# Altium schematic sheet BumpSensors.SchDoc
size A
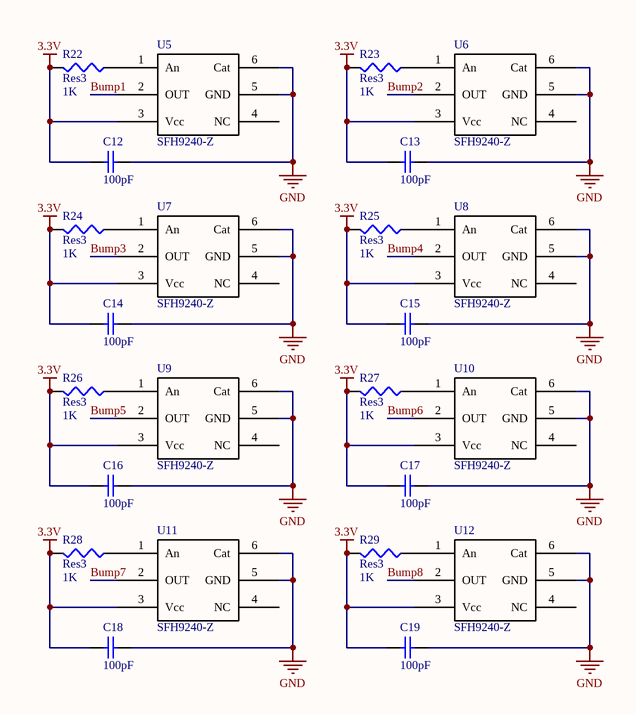
[diagram p0: BumpSensors.SchDoc]

## Parts
C12  value 100pF  [CAPC1005L]  (hidden comment: Cap Semi)
C13  value 100pF  [CAPC1005L]  (hidden comment: Cap Semi)
C14  value 100pF  [CAPC1005L]  (hidden comment: Cap Semi)
C15  value 100pF  [CAPC1005L]  (hidden comment: Cap Semi)
C16  value 100pF  [CAPC1005L]  (hidden comment: Cap Semi)
C17  value 100pF  [CAPC1005L]  (hidden comment: Cap Semi)
C18  value 100pF  [CAPC1005L]  (hidden comment: Cap Semi)
C19  value 100pF  [CAPC1005L]  (hidden comment: Cap Semi)
R22  Res3  value 1K  [RESC1608L]
R23  Res3  value 1K  [RESC1608L]
R24  Res3  value 1K  [RESC1608L]
R25  Res3  value 1K  [RESC1608L]
R26  Res3  value 1K  [RESC1608L]
R27  Res3  value 1K  [RESC1608L]
R28  Res3  value 1K  [RESC1608L]
R29  Res3  value 1K  [RESC1608L]
U5  SFH9240-Z  [SFH9240-Z]
U6  SFH9240-Z  [SFH9240-Z]
U7  SFH9240-Z  [SFH9240-Z]
U8  SFH9240-Z  [SFH9240-Z]
U9  SFH9240-Z  [SFH9240-Z]
U10  SFH9240-Z  [SFH9240-Z]
U11  SFH9240-Z  [SFH9240-Z]
U12  SFH9240-Z  [SFH9240-Z]

## Nets
3.3V: C12.2 C13.2 C14.2 C15.2 C16.2 C17.2 C18.2 C19.2 R22.2 R23.2 R24.2 R25.2 R26.2 R27.2 R28.2 R29.2 U5.3(Vcc) U6.3(Vcc) U7.3(Vcc) U8.3(Vcc) U9.3(Vcc) U10.3(Vcc) U11.3(Vcc) U12.3(Vcc)
GND: C12.1 C13.1 C14.1 C15.1 C16.1 C17.1 C18.1 C19.1 U5.5(GND) U5.6(Cat) U6.5(GND) U6.6(Cat) U7.5(GND) U7.6(Cat) U8.5(GND) U8.6(Cat) U9.5(GND) U9.6(Cat) U10.5(GND) U10.6(Cat) U11.5(GND) U11.6(Cat) U12.5(GND) U12.6(Cat)
Bump1: U5.2(OUT)
Bump2: U6.2(OUT)
Bump3: U7.2(OUT)
Bump4: U8.2(OUT)
Bump5: U9.2(OUT)
Bump6: U10.2(OUT)
Bump7: U11.2(OUT)
Bump8: U12.2(OUT)
NetR22_1: R22.1 U5.1(An)
NetR23_1: R23.1 U6.1(An)
NetR24_1: R24.1 U7.1(An)
NetR25_1: R25.1 U8.1(An)
NetR26_1: R26.1 U9.1(An)
NetR27_1: R27.1 U10.1(An)
NetR28_1: R28.1 U11.1(An)
NetR29_1: R29.1 U12.1(An)

Not connected (* = marked no-connect by the designer): U5 4(NC); U6 4(NC); U7 4(NC); U8 4(NC); U9 4(NC); U10 4(NC); U11 4(NC); U12 4(NC)

## Library data of the parts
C12-C19 = Cap Semi: Capacitor (Semiconductor SIM Model); Published: 8-Jun-2000; LatestRevisionDate: 29-May-2009; LatestRevisionNote: IPC-7351 Footprint Added.; PackageReference: C1206; Publisher: Altium Limited; PackageDescription: Chip Capacitor
R22-R29 = Res3: Resistor; Published: 8-Jun-2000; LatestRevisionDate: 29-May-2009; LatestRevisionNote: IPC-7351 Footprint Added.; PackageReference: J1-0603; Publisher: Altium Limited; PackageDescription: Chip Resistor